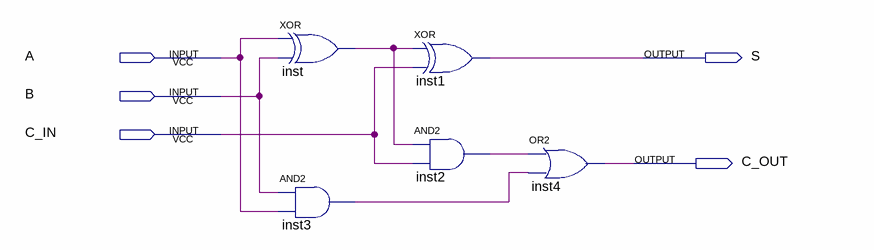
[diagram p0: schematic sheet]
// Quartus schematic OneBitFullAdder.bdf as structural Verilog: 5 symbols, 5 pins
module OneBitFullAdder (
  input  A,
  input  B,
  input  C_IN,
  output S,
  output C_OUT
);

  wire inst2_out, inst3_out, inst_out;

  xor inst (inst_out, A, B);
  and inst3 (inst3_out, B, A);
  xor inst1 (S, inst_out, C_IN);
  and inst2 (inst2_out, inst_out, C_IN);
  or inst4 (C_OUT, inst2_out, inst3_out);
endmodule
